# Altium schematic sheet SD_Share.SchDoc
size Tabloid; DrawnBy: V-P.Rheaume@USherbrooke.ca; Organization: Universite de Sherbrooke; Address1: L3, 12a Rodborough Rd; Address2: Frenchs Forest; Address3: NSW; Address4: Australia 2086; Revision: 0; SheetNumber: 5; SheetTotal: 8; SheetName: SD Card Sharing
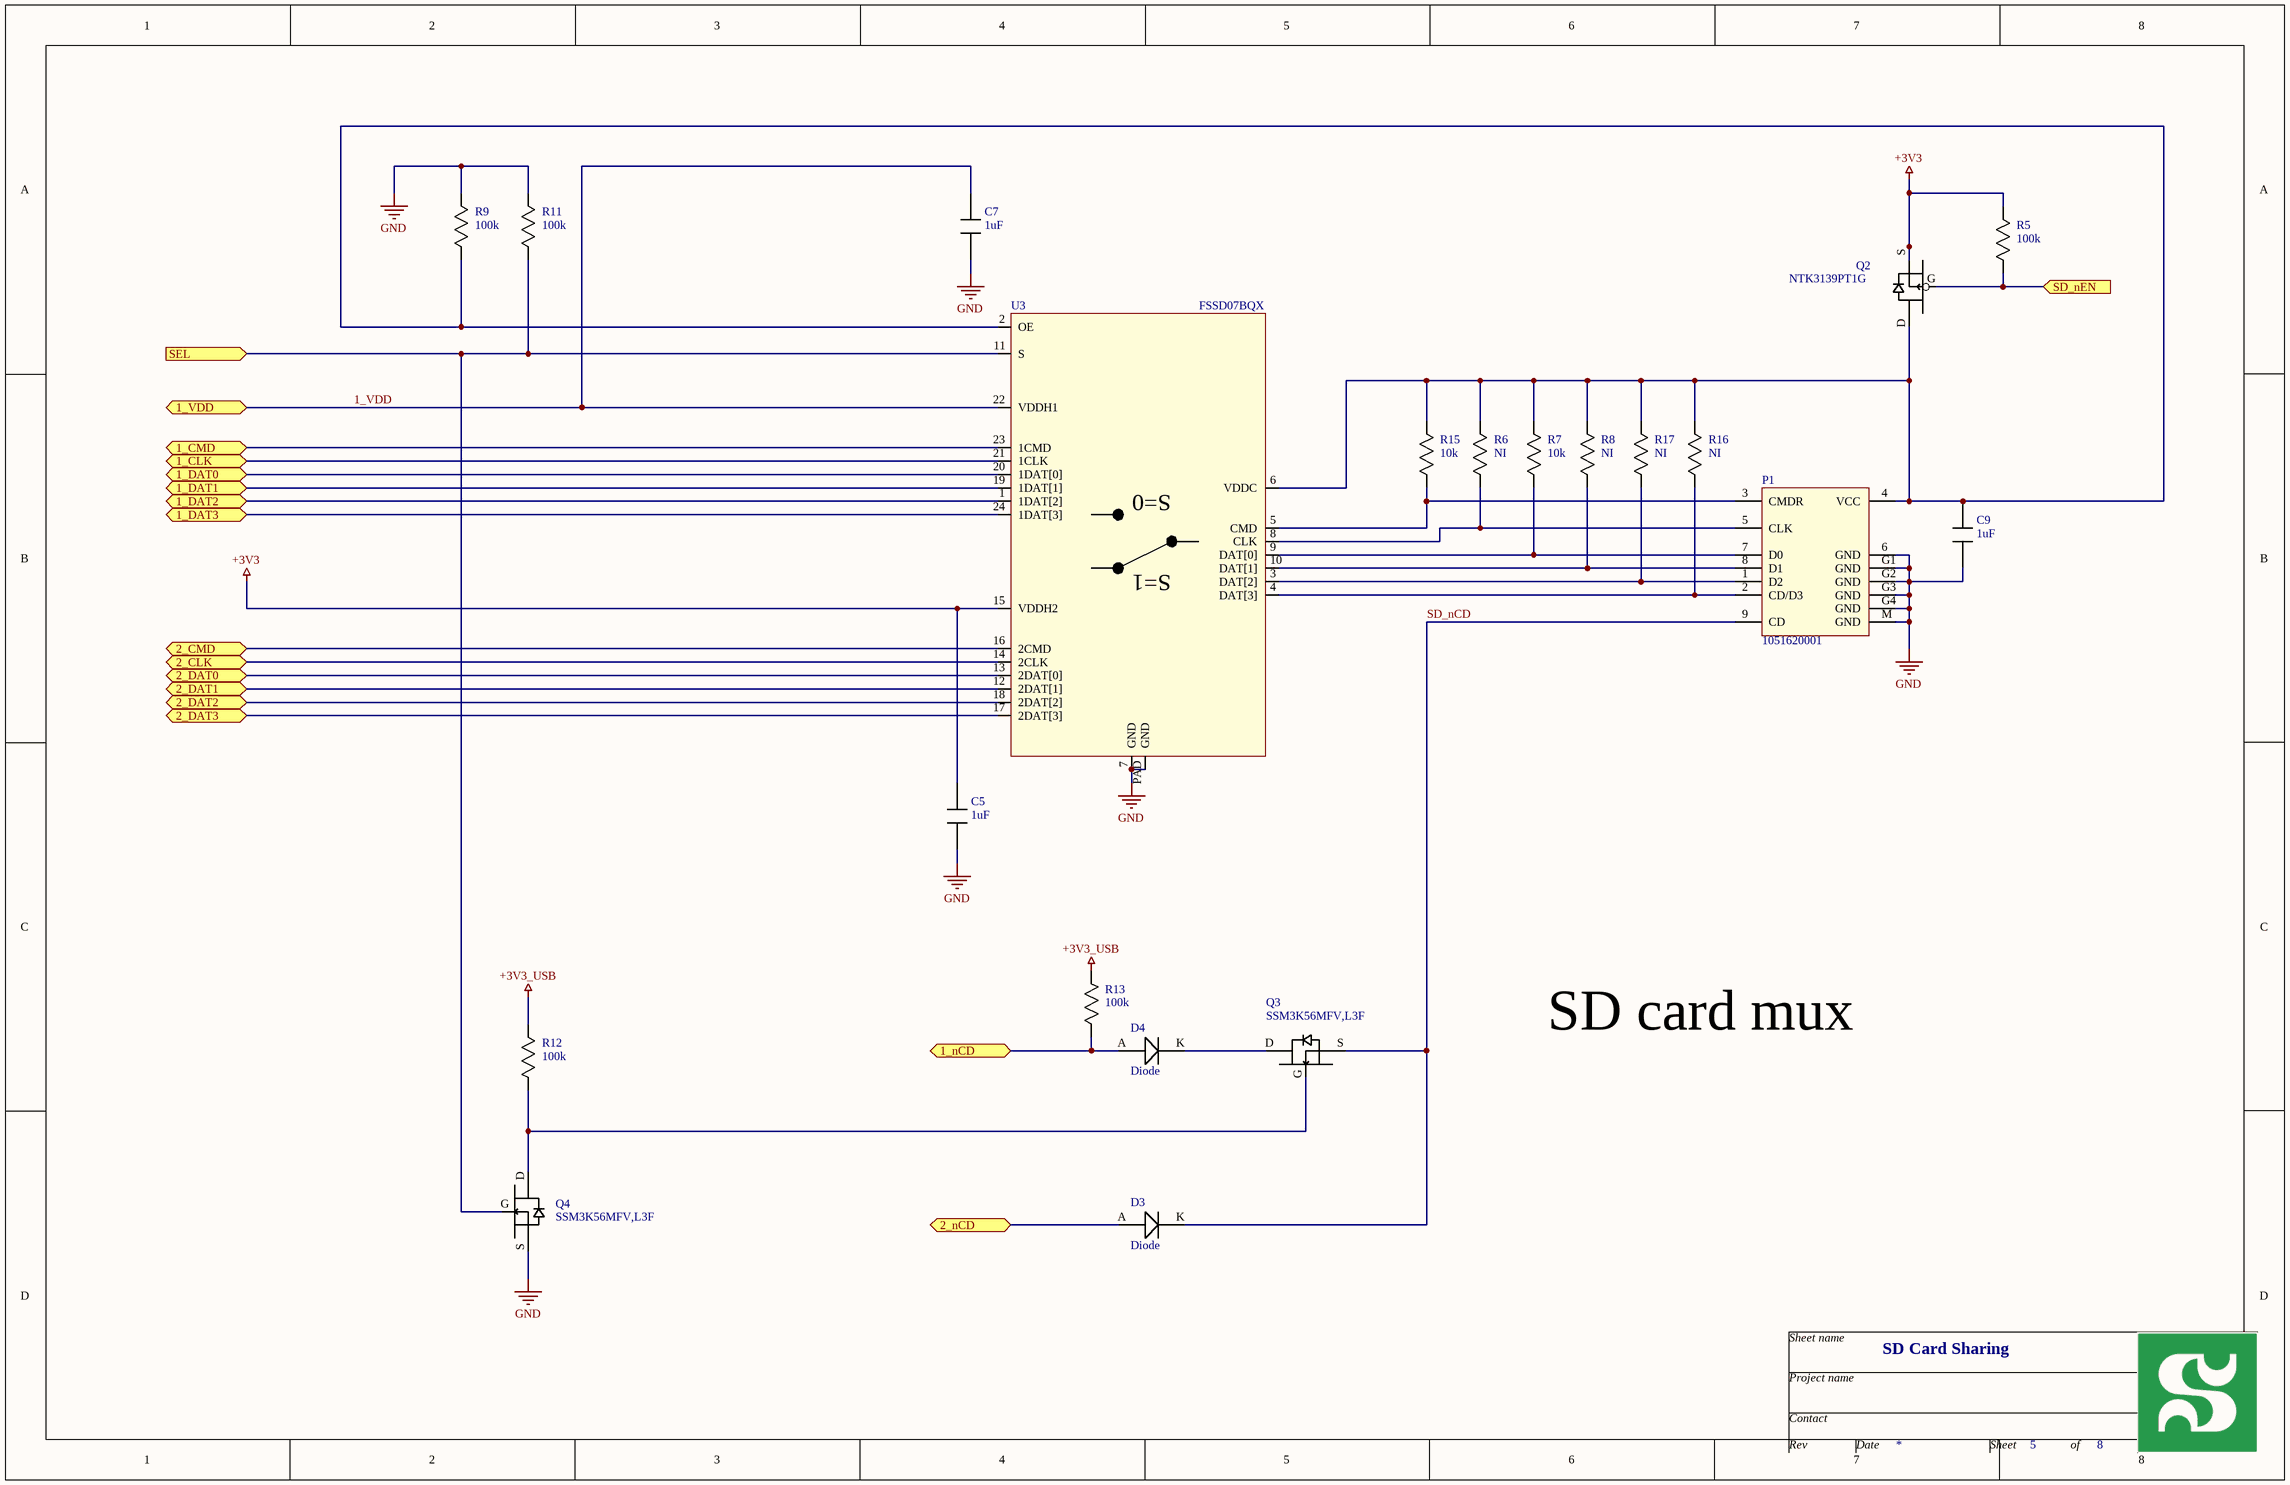
[diagram p0: SD_Share.SchDoc]

## Parts
C5  value 1uF  [0603]  (hidden comment: Capacitor)
C7  value 1uF  [0603]  (hidden comment: Capacitor)
C9  value 1uF  [0603]  (hidden comment: Capacitor)
D3  Diode  [DIODE_SOD523]
D4  Diode  [DIODE_SOD523]
P1  Mfg_PN: 1051620001  [CONN_uSD_MOLEX_1051620001]  (hidden comment: CON_uSD_1051620001)
Q2  Mfg_PN: NTK3139PT1G  [SOT723]  (hidden comment: MOSFET_P_GDS)
Q3  Mfg_PN: SSM3K56MFV,L3F  [SOT723]  (hidden comment: MOSFET_N_GDS)
Q4  Mfg_PN: SSM3K56MFV,L3F  [SOT723]  (hidden comment: MOSFET_N_GDS)
R5  value 100k  [0402]  (hidden comment: Resistor)
R6  Resistor  [0402]  (value not drawn)
R7  value 10k  [0402]  (hidden comment: Resistor)
R8  Resistor  [0402]  (value not drawn)
R9  value 100k  [0402]  (hidden comment: Resistor)
R11  value 100k  [0402]  (hidden comment: Resistor)
R12  value 100k  [0402]  (hidden comment: Resistor)
R13  value 100k  [0402]  (hidden comment: Resistor)
R15  value 10k  [0402]  (hidden comment: Resistor)
R16  Resistor  [0402]  (value not drawn)
R17  Resistor  [0402]  (value not drawn)
U3  FSSD07BQX  [MLP24]

## Ports
1_CLK (bidir), 1_CMD (bidir), 1_DAT0 (bidir), 1_DAT1 (bidir), 1_DAT2 (bidir), 1_DAT3 (bidir), 1_nCD (bidir), 1_VDD (bidir), 2_CLK (bidir), 2_CMD (bidir), 2_DAT0 (bidir), 2_DAT1 (bidir), 2_DAT2 (bidir), 2_DAT3 (bidir), 2_nCD (bidir), SD_nEN (in), SEL (in)

## Nets
+3V3: C5.1 Q2.S R5.1 U3.15(VDDH2)
+3V3_USB: R12.1 R13.1
GND: C5.2 C7.2 C9.2 P1.6(GND) P1.G1(GND) P1.G2(GND) P1.G3(GND) P1.G4(GND) P1.M(GND) Q4.S R9.1 R11.1 U3.7(GND) U3.PAD(GND)
1_CLK: U3.21(1CLK) ; port 1_CLK
1_CMD: U3.23(1CMD) ; port 1_CMD
1_DAT0: U3.20(1DAT[0]) ; port 1_DAT0
1_DAT1: U3.19(1DAT[1]) ; port 1_DAT1
1_DAT2: U3.1(1DAT[2]) ; port 1_DAT2
1_DAT3: U3.24(1DAT[3]) ; port 1_DAT3
1_nCD: D4.A R13.2 ; port 1_nCD
1_VDD: C7.1 U3.22(VDDH1) ; port 1_VDD
2_CLK: U3.14(2CLK) ; port 2_CLK
2_CMD: U3.16(2CMD) ; port 2_CMD
2_DAT0: U3.13(2DAT[0]) ; port 2_DAT0
2_DAT1: U3.12(2DAT[1]) ; port 2_DAT1
2_DAT2: U3.18(2DAT[2]) ; port 2_DAT2
2_DAT3: U3.17(2DAT[3]) ; port 2_DAT3
2_nCD: D3.A ; port 2_nCD
SD_nCD: D3.K P1.9(CD) Q3.S
SD_nEN: Q2.G R5.2 ; port SD_nEN
SEL: Q4.G R11.2 U3.11(S) ; port SEL
NetC9_1: C9.1 P1.4(VCC) Q2.D R6.1 R7.1 R8.1 R9.2 R15.1 R16.1 R17.1 U3.2(OE) U3.6(VDDC)
NetD4_K: D4.K Q3.D
NetP1_1: P1.1(D2) R17.2 U3.3(DAT[2])
NetP1_2: P1.2(CD/D3) R16.2 U3.4(DAT[3])
NetP1_3: P1.3(CMDR) R15.2 U3.5(CMD)
NetP1_5: P1.5(CLK) R6.2 U3.8(CLK)
NetP1_7: P1.7(D0) R7.2 U3.9(DAT[0])
NetP1_8: P1.8(D1) R8.2 U3.10(DAT[1])
NetQ3_G: Q3.G Q4.D R12.2

## Notes on the sheet
- SD card mux
- Sheet name
- Project name
- Contact
- Rev
- Date
- Sheet
- of
- (in symbol FSSD07BQX) S=0; S=1

## Library data of the parts
C5 C7 C9 = Capacitor: Mfg: Samsung; Mfg_PN: CL10A105KP8NNNC; HelpURL: *; NI: *; Supplier1: Digikey; Supplier1_PN: 1276-1182-1-ND; Tolerance: *; Type: *; Rating: *
D3 D4 = Diode: Mfg: MCC; Mfg_PN: 1N4148X-TP; HelpURL: *; NI: *; Supplier1: Digikey; Supplier1_PN: 1N4148XTPMSCT-ND; Tolerance: *; Type: *; Rating: *; Value: *
P1 = CON_uSD_1051620001: Micro-SD card slot; Mfg: Molex; HelpURL: *; NI: *; Rating: *; Supplier1: Digikey; Supplier1_PN: WM14405CT-ND; Tolerance: *; Type: uSD; Value: *
Q2 = MOSFET_P_GDS: PMOS; Mfg: OnSemi; HelpURL: *; NI: *; Rating: *; Supplier1: Digikey; Supplier1_PN: NTK3139PT1GOSCT-ND; Tolerance: *; Type: *; Value: *
Q3 Q4 = MOSFET_N_GDS: NMOS; Mfg: Toshiba; HelpURL: *; NI: *; Rating: *; Supplier1: Digikey; Supplier1_PN: SSM3K56MFVL3FCT-ND; Tolerance: *; Type: *; Value: *
R5 R9 R11-R13 = Resistor: Mfg: Yageo; Mfg_PN: RC0402JR-07100KL; HelpURL: *; NI: *; Supplier1: Digikey; Supplier1_PN: 311-100KJRCT-ND; Type: *; Rating: *; Tolerance: *
R6 R8 R16 R17 = Resistor: Mfg: Yageo; Mfg_PN: RC0402FR-0710KL; Value: 10k; HelpURL: *; NI: NI; Supplier1: Digikey; Supplier1_PN: 311-10.0KLRCT-ND; Type: *; Rating: *; Tolerance: *
R7 R15 = Resistor: Mfg: Yageo; Mfg_PN: RC0402FR-0710KL; HelpURL: *; NI: *; Supplier1: Digikey; Supplier1_PN: 311-10.0KLRCT-ND; Type: *; Rating: *; Tolerance: *
U3 = FSSD07BQX: SD Card Host multiplexer; Mfg: OnSemi; HelpURL: *; Mfg_PN: FSSD07BQX; NI: *; Supplier1: Digikey; Supplier1_PN: FSSD07BQXCT-ND; Type: *